# Altium project QCM_hardware.PrjPcb
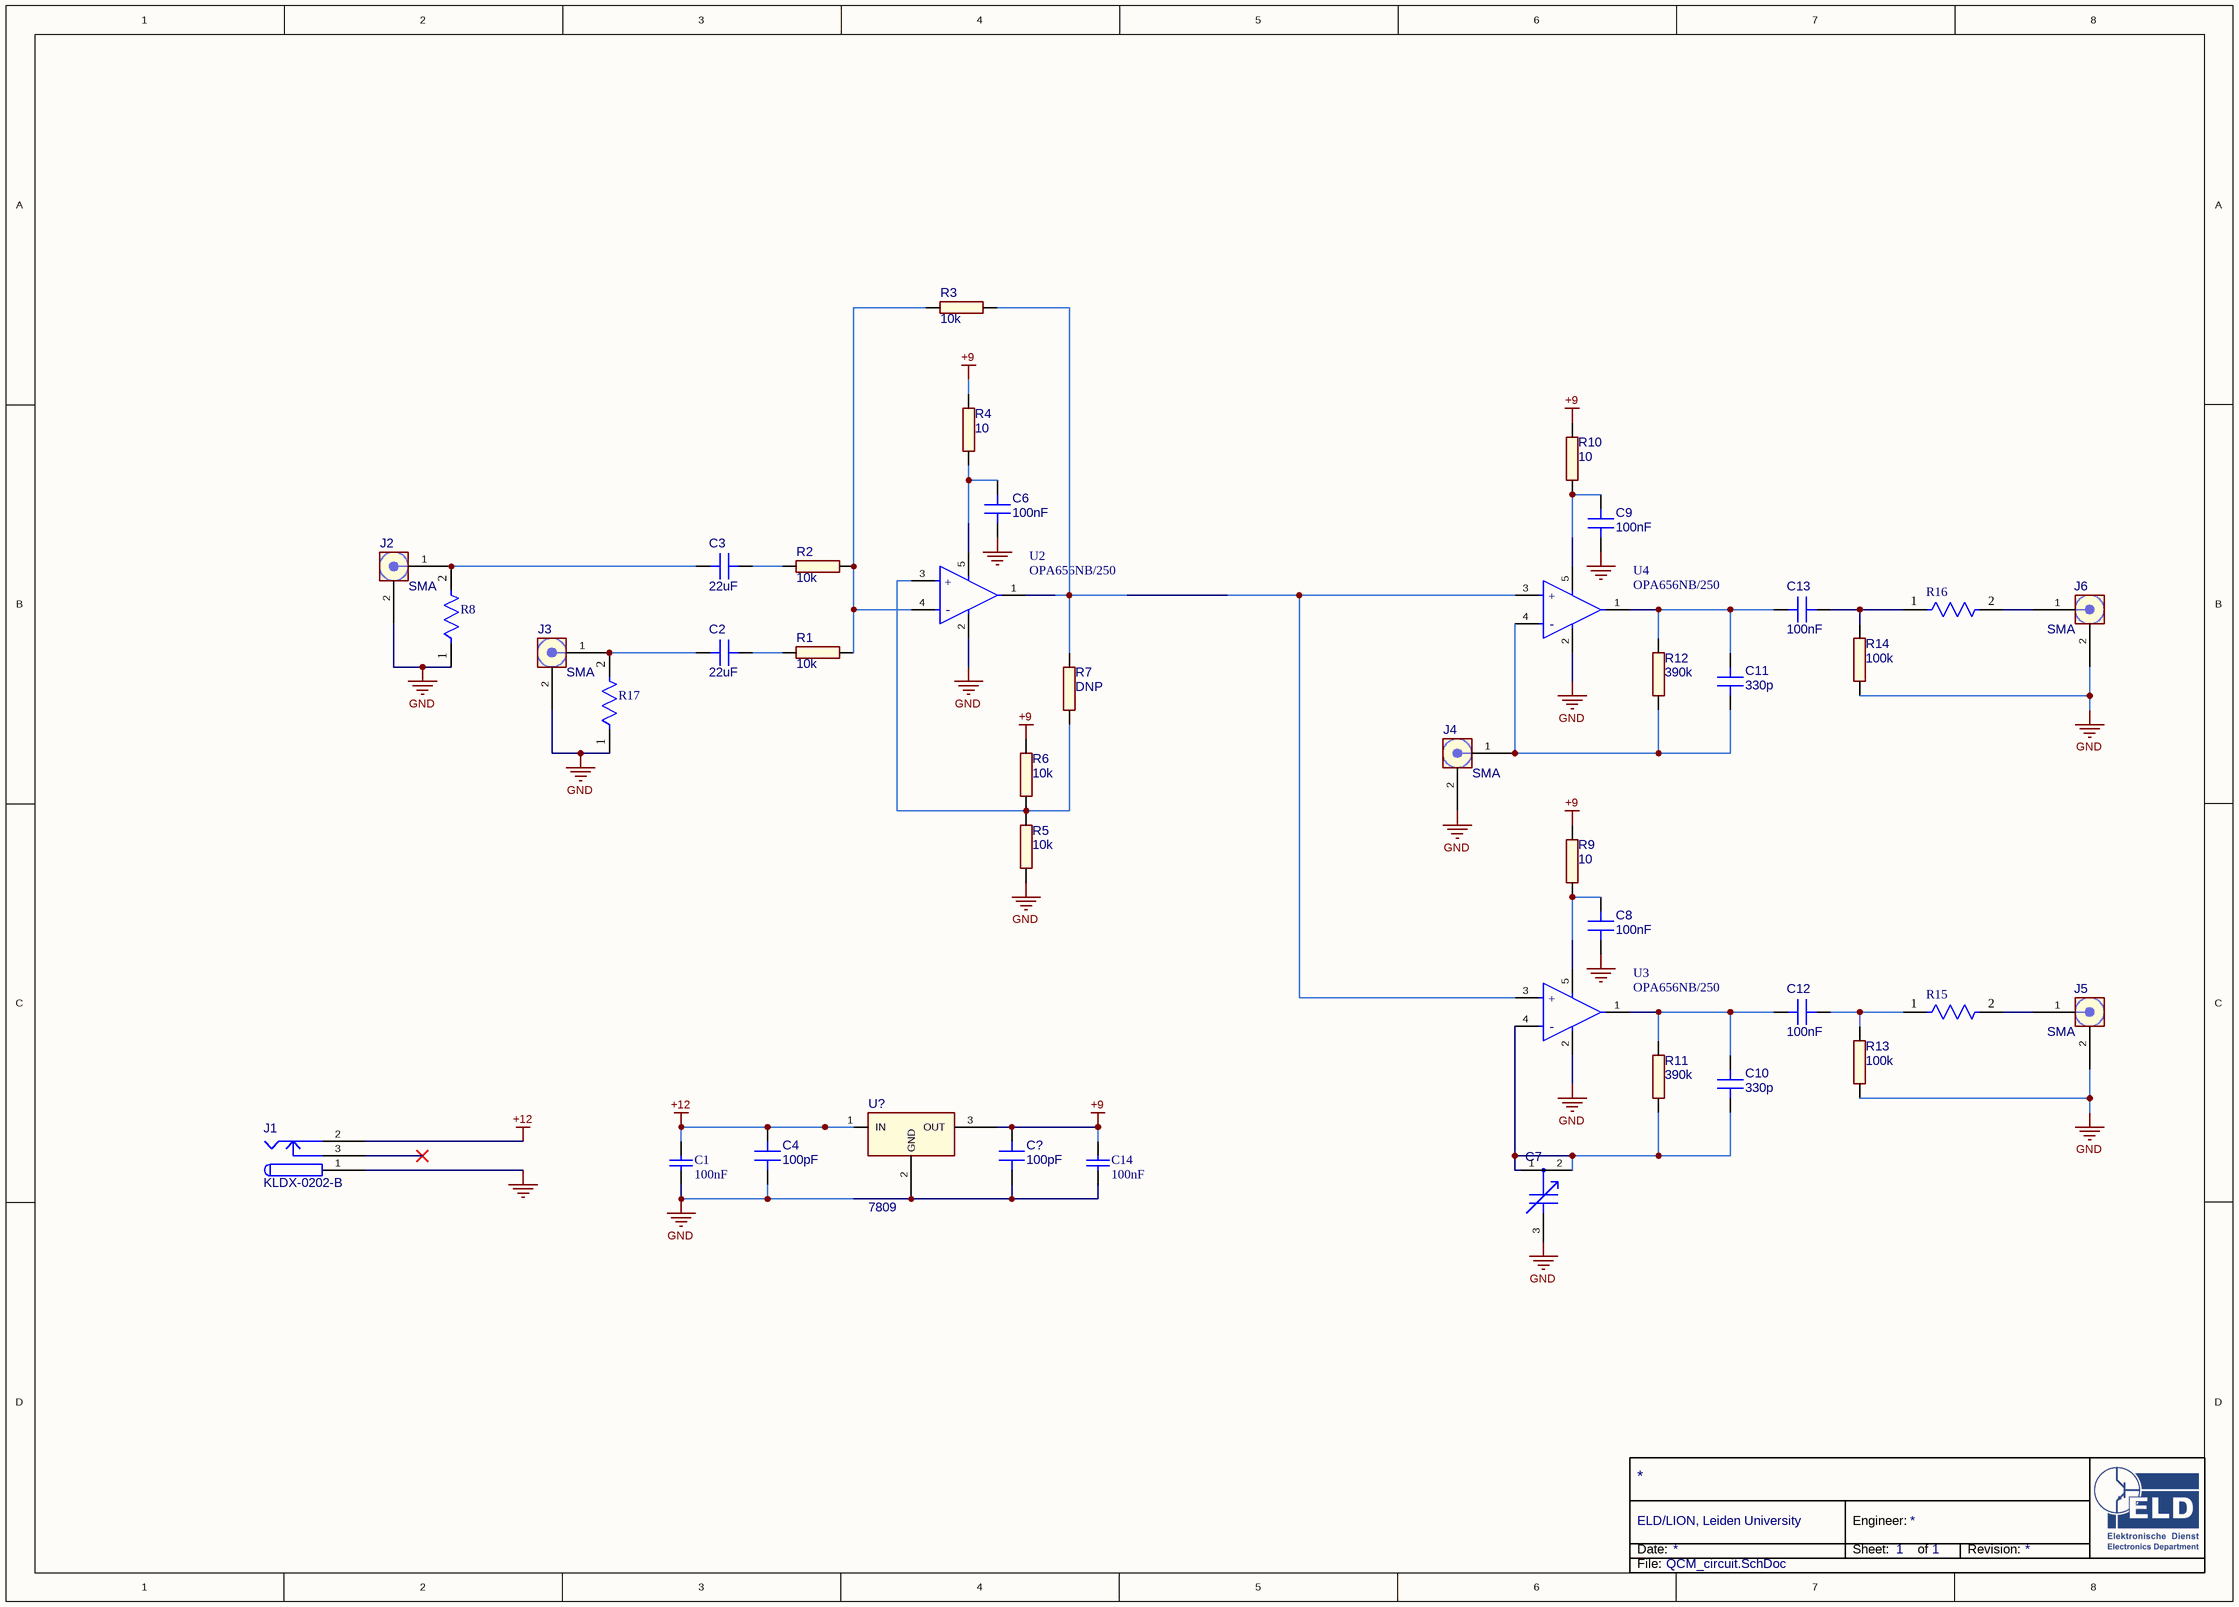
[diagram p0: QCM_circuit.SchDoc]
1 sheet, 42 parts. Net scope: global (net labels, ports and power ports of the same name join across sheets).
Board file: QCM_circuit.PcbDoc

## Sheet QCM_circuit.SchDoc
size A3; SheetNumber: 1; SheetTotal: 1

### Parts
?  (no value)  (graphical)
C1  100nF  [CAPC1206(3216)170_N]
C2  22uF  [C_0805]
C3  22uF  [C_0805]
C4  100pF  [C_0805]
C6  100nF  [C_0805]
C7  FC280832659  [FP-BFC280832659-MFG]  (value not drawn)
C8  100nF  [C_0805]
C9  100nF  [C_0805]
C10  330p  [C_0805]
C11  330p  [C_0805]
C12  100nF  [C_0805]
C13  100nF  [C_0805]
C14  100nF  [CAPC1206(3216)170_N]
C?  100pF  [C_0805]
J1  KLDX-0202-B  [KYCN-KLDX-0202-B_V]
J2  SMA  [SMA_SM_JOHNSON_142-0701-841]
J3  SMA  [SMA_SM_JOHNSON_142-0701-841]
J4  SMA  [SMA_SM_JOHNSON_142-0701-841]
J5  SMA  [SMA_SM_JOHNSON_142-0701-841]
J6  SMA  [SMA_SM_JOHNSON_142-0701-841]
R1  10k  [R_0805]
R2  10k  [R_0805]
R3  10k  [R_0805]
R4  10  [R_0805]
R5  10k  [R_0805]
R6  10k  [R_0805]
R7  DNP  [R_0805]
R8  CRCW080550R0FKTA  [FP-D12-CRCW0805-MFG]  (value not drawn)
R9  10  [R_0805]
R10  10  [R_0805]
R11  390k  [R_0805]
R12  390k  [R_0805]
R13  100k  [R_0805]
R14  100k  [R_0805]
R15  CRCW080550R0FKTA  [FP-D12-CRCW0805-MFG]  (value not drawn)
R16  CRCW080550R0FKTA  [FP-D12-CRCW0805-MFG]  (value not drawn)
R17  CRCW080550R0FKTA  [FP-D12-CRCW0805-MFG]  (value not drawn)
U2  OPA656NB/250  [FP-DBV0005A-IPC_A]
U3  OPA656NB/250  [FP-DBV0005A-IPC_A]
U4  OPA656NB/250  [FP-DBV0005A-IPC_A]
U?  7809  [TO220V]

### Nets
+9: C14.2 C?.2 R4.1 R6.1 R9.1 R10.1 U?.3(OUT)
+12: C1.2 C4.2 J1.2 U?.1(IN)
GND: C1.1 C4.1 C6.2 C7.3(S) C8.2 C9.2 C14.1 C?.1 J1.1 J2.2(SHIELD) J3.2(SHIELD) J4.2(SHIELD) J5.2(SHIELD) J6.2(SHIELD) R5.2 R8.1 R13.2 R14.2 R17.1 U2.2(-VS) U3.2(-VS) U4.2(-VS) U?.2(GND)
NetC2_1: C2.1 J3.1(CENTER) R17.2
NetC2_2: C2.2 R1.2
NetC3_1: C3.1 J2.1(CENTER) R8.2
NetC3_2: C3.2 R2.2
NetC6_1: C6.1 R4.2 U2.5(+VS)
NetC7_1: C7.1(R) C7.2(R) C10.2 R11.1 U3.4(VIN-)
NetC8_1: C8.1 R9.2 U3.5(+VS)
NetC9_1: C9.1 R10.2 U4.5(+VS)
NetC10_1: C10.1 C12.1 R11.2 U3.1(VOUT)
NetC11_1: C11.1 C13.1 R12.2 U4.1(VOUT)
NetC11_2: C11.2 J4.1(CENTER) R12.1 U4.4(VIN-)
NetC12_2: C12.2 R13.1 R15.1
NetC13_2: C13.2 R14.1 R16.1
NetJ5_1: J5.1(CENTER) R15.2
NetJ6_1: J6.1(CENTER) R16.2
NetR1_1: R1.1 R2.1 R3.2 U2.4(VIN-)
NetR3_1: R3.1 R7.1 U2.1(VOUT) U3.3(VIN+) U4.3(VIN+)
NetR5_1: R5.1 R6.2 R7.2 U2.3(VIN+)

Not connected (* = marked no-connect by the designer): J1 3*

### Notes on the sheet
- Date:
- ELD/LION, Leiden University
- Engineer:
- Sheet:
- of
- Revision:
- File:
- (in symbol CMP-0018-00414-3) +; -

### Library data of the parts
? = TitleBlock-ELD
C1 C14 = CMP-1037-04098-1: CAP 68nF 100V ±5% 1206 (3216 Metric) Thickness 1.7mm SMD; Case-Metric: 3216; Case-EIA: 1206; Tolerance: Â±5%; Technology: SMT; Value: 68nF; Max Thickness: 1.7 mm; Rated Voltage: 100 V
C2-C4 C6 C8-C13 C? = C_0805
C7 = CMP-02422-000001-1: CAP TRIMMER 5.5-65PF 150V TH; Manufacturer: Vishay BC Components; Manufacturer Part Number: BFC280832659; Temperature Coefficient: +300/-700ppm/°C; Material: Polypropylene; Category: Cap; Voltage Rating: 150V; Octopart: https://octopart.com/bfc280832659-vishay-41937824; Device Class L2: Capacitors; Device Class L1: Passive Components; Value: 5.5-65pF; Temperature Range Low: -40°C; Capacitance: 5.5-65pF; ComponentLink2URL: https://www.vishay.com/docs/28528/bfc2808-10mm.pdf; Temperature: -40°C to +70°C; ComponentLink2Description: Datasheet; Temperature Range High: +70°C; Device Class L3: Trimmer / Variable Capacitors; RoHS: TRUE; Lead Free: Yes; Digikey Description: CAP TRIMMER 5.5-65PF 150V TH; Automotive: No; Package: BFC280832659; Mouser Description: Trimmer / Variable Capacitors TRIMMER CAPACITOR; Height: 11mm
J1 = CMP-0256-00001-1: 3 Conductor Power Jack, 2 break 2 aux contacts; ComponentLink2URL: http://anacapa.kycon.com/Catalog_PDF/KLDX_0202.pdf; PackageReference: KLDX-0202-B; Contact Finish: Brass; ComponentLink2Description: Datasheet; Mounting Technology: Through Hole; PackageDescription: Jack, 9 x 14.5 mm Body, 2.5 mm Center Pin Diameter; ComponentLink1Description: Manufacturer URL; PartNumber: KLDX-0202-B; ComponentLink1URL: http://kycon.com/
J2-J6 = SMA_SM_JOHNSON_142-0701-841
R1-R7 R9-R14 = R_0805
R8 R15-R17 = CMP-00030-21390498-1: CRCW080550R0FKTA Res Thick Film 0805 50 Ohm 1% 0.125W(1/8W) ±100ppm/C Pad SMD Automotive T/R; Temperature Coefficient: 100ppm/°C; Resistance: 50Ω; Voltage Rating: 150V; Power Rating: 125mW; Length: 2mm; Case Code (Imperial): 0805; Height: 450µm; Contact Plating: Lead, Tin; Width: 1.25mm; Max Operating Temperature: 155°C; NexarPartId: 21390498; Case Code (Metric): 2012; Min Operating Temperature: -55°C; Tolerance: 1%; Case/Package: 0805; Lead Free: Contains Lead; RoHS: Non-Compliant; Composition: Thick Film; Weight: 5.499807mg
U2-U4 = CMP-0018-00414-3: IC OPAMP VFB 1 CIRCUIT SOT23-5; Number of Elements: 1; Max Dual Supply Voltage: 6V; Input Bias Current: 20pA; Slew Rate: 290V/µs; Power Supply Rejection Ratio (PSRR): 74dB; Common Mode Rejection Ratio: 88dB; Operating Supply Voltage: 12V; Settling Time: 16ns; Dual Supply Voltage: 5V; Unity Gain Bandwidth Product: 230MHz; Nominal Supply Current: 16mA; Min Supply Voltage: 10V; Input Offset Voltage (Vos): 600uV; Packaging: Tape and Reel; Lead Free: Lead Free; Max Operating Temperature: 85°C; Width: 1.6mm; Min Operating Temperature: -40°C; Number of Circuits: 1; Package Quantity: 250; Number of Pins: 5; Case/Package: SOT-23; Height: 1.15mm; Max Supply Voltage: 12V; Number of Channels: 1; Length: 2.9mm; Number of Amplifiers: 1; Max I/O Voltage: 600uV; Bandwidth: 230MHz; REACH SVHC: No SVHC; Radiation Hardening: No; Gain Bandwidth Product: 230MHz
U? = 7809: Standard +9V 1A positive fixed voltage regulator in TO-220 housing; Manufacturer 1: STMicroelectronics; Manufacturer Part Number 1: L7809CV; Description 1: STMICROELECTRONICS - L7809CV - IC, V REG +9.0V, 7809, TO-220-3; Max Input Voltage: 35V; Min Input Voltage: 11V; Output Type: Fixed,Adjustable; Number of Outputs: 1; Output Voltage: 9V; Dropout Voltage: 2V; Output Current: 1.5A; Quiescent Current: 8mA; Power Supply Rejection Ratio (PSRR): 55dB; Accuracy: 2%; Tolerance: 5%; ComponentLink1URL: http://www.jameco.com/Jameco/Products/ProdDS/902071.pdf; ComponentLink1Description: http://www.jameco.com/Jameco/Products/ProdDS/902071.pdf; ComponentLink2URL: http://www.ti.com/lit/ds/symlink/lm7805c.pdf; ComponentLink2Description: http://www.ti.com/lit/ds/symlink/lm7805c.pdf; ComponentLink3URL: http://www.ti.com/general/docs/lit/getliterature.tsp?genericPartNumber=LM7815C&&fileType=pdf; ComponentLink3Description: http://www.ti.com/general/docs/lit/getliterature.tsp?genericPartNumber=LM7815C&&fileType=pdf; Supplier 1: Mouser; Supplier Part Number 1: 511-L7809CV; Stock 1: 8768; Pricing: 1=0.45, 10=0.374, 50=0.374, 100=0.228, 1000=0.176, 2000=0.15, 10000=0.14, 25000=0.133, 50000=0.13, 100000=0.125 (USD); RoHS: Yes; Mount: Through Hole; Case/Package: TO; Number of Pins: 3; Weight: 0.01lb; Min Operating Temperature: 0°C; Max Operating Temperature: 125°C; Packaging: Rail/Tube; Package Quantity: 50; Polarity: Positive; Min Output Voltage: 9V; Max Output Current: 1.5A; Number of Regulators: 1; Nominal Output Voltage: 9V; Output Configuration: Positive; Length: 10.4mm; Height: 14.9mm; Width: 4.6mm; Radiation Hardening: No; REACH SVHC: No SVHC; Lead Free: Lead Free; ComponentLink4URL: https://datasheet.ciiva.com/27055/1991694-27055797.pdf?src-supplier=Jameco; ComponentLink4Description: https://datasheet.ciiva.com/27055/1991694-27055797.pdf?src-supplier=Jameco; ComponentLink5URL: https://datasheet.ciiva.com/26331/179191-da-01-en-spannungsregler-l7809cv-to-220-stm-26331022.pdf?src-supplier=Conrad; ComponentLink5Description: https://datasheet.ciiva.com/26331/179191-da-01-en-spannungsregler-l7809cv-to-220-stm-26331022.pdf?src-supplier=Conrad; ComponentLink6URL: https://datasheet.ciiva.com/1511/1805459-1511921.pdf?src-supplier=Element14; ComponentLink6Description: https://datasheet.ciiva.com/1511/1805459-1511921.pdf?src-supplier=Element14; ComponentLink7URL: https://datasheet.ciiva.com/2044/cd00000444-2044161.pdf?src-supplier=Digi-Key; ComponentLink7Description: https://datasheet.ciiva.com/2044/cd00000444-2044161.pdf?src-supplier=Digi-Key; ComponentLink8URL: https://datasheet.ciiva.com/16393/cd00000444-16393733.pdf?src-supplier=Future+Electronics; ComponentLink8Description: https://datasheet.ciiva.com/16393/cd00000444-16393733.pdf?src-supplier=Future+Electronics; ComponentLink9URL: https://datasheet.ciiva.com/3224/cd00000444-3224953.pdf?src-supplier=Avnet; ComponentLink9Description: https://datasheet.ciiva.com/3224/cd00000444-3224953.pdf?src-supplier=Avnet; ComponentLink10URL: https://datasheet.ciiva.com/18404/70013895-18404043.pdf?src-supplier=Allied+Electronics; ComponentLink10Description: https://datasheet.ciiva.com/18404/70013895-18404043.pdf?src-supplier=Allied+Electronics

## Assembly variants
QCM_hardware_with_summing_amp: not fitted R7
QCM_hardware_without_summing_amp: not fitted C2 C6 J3 R1 R4 R17 U2; alternate parts R2 -> R_0805